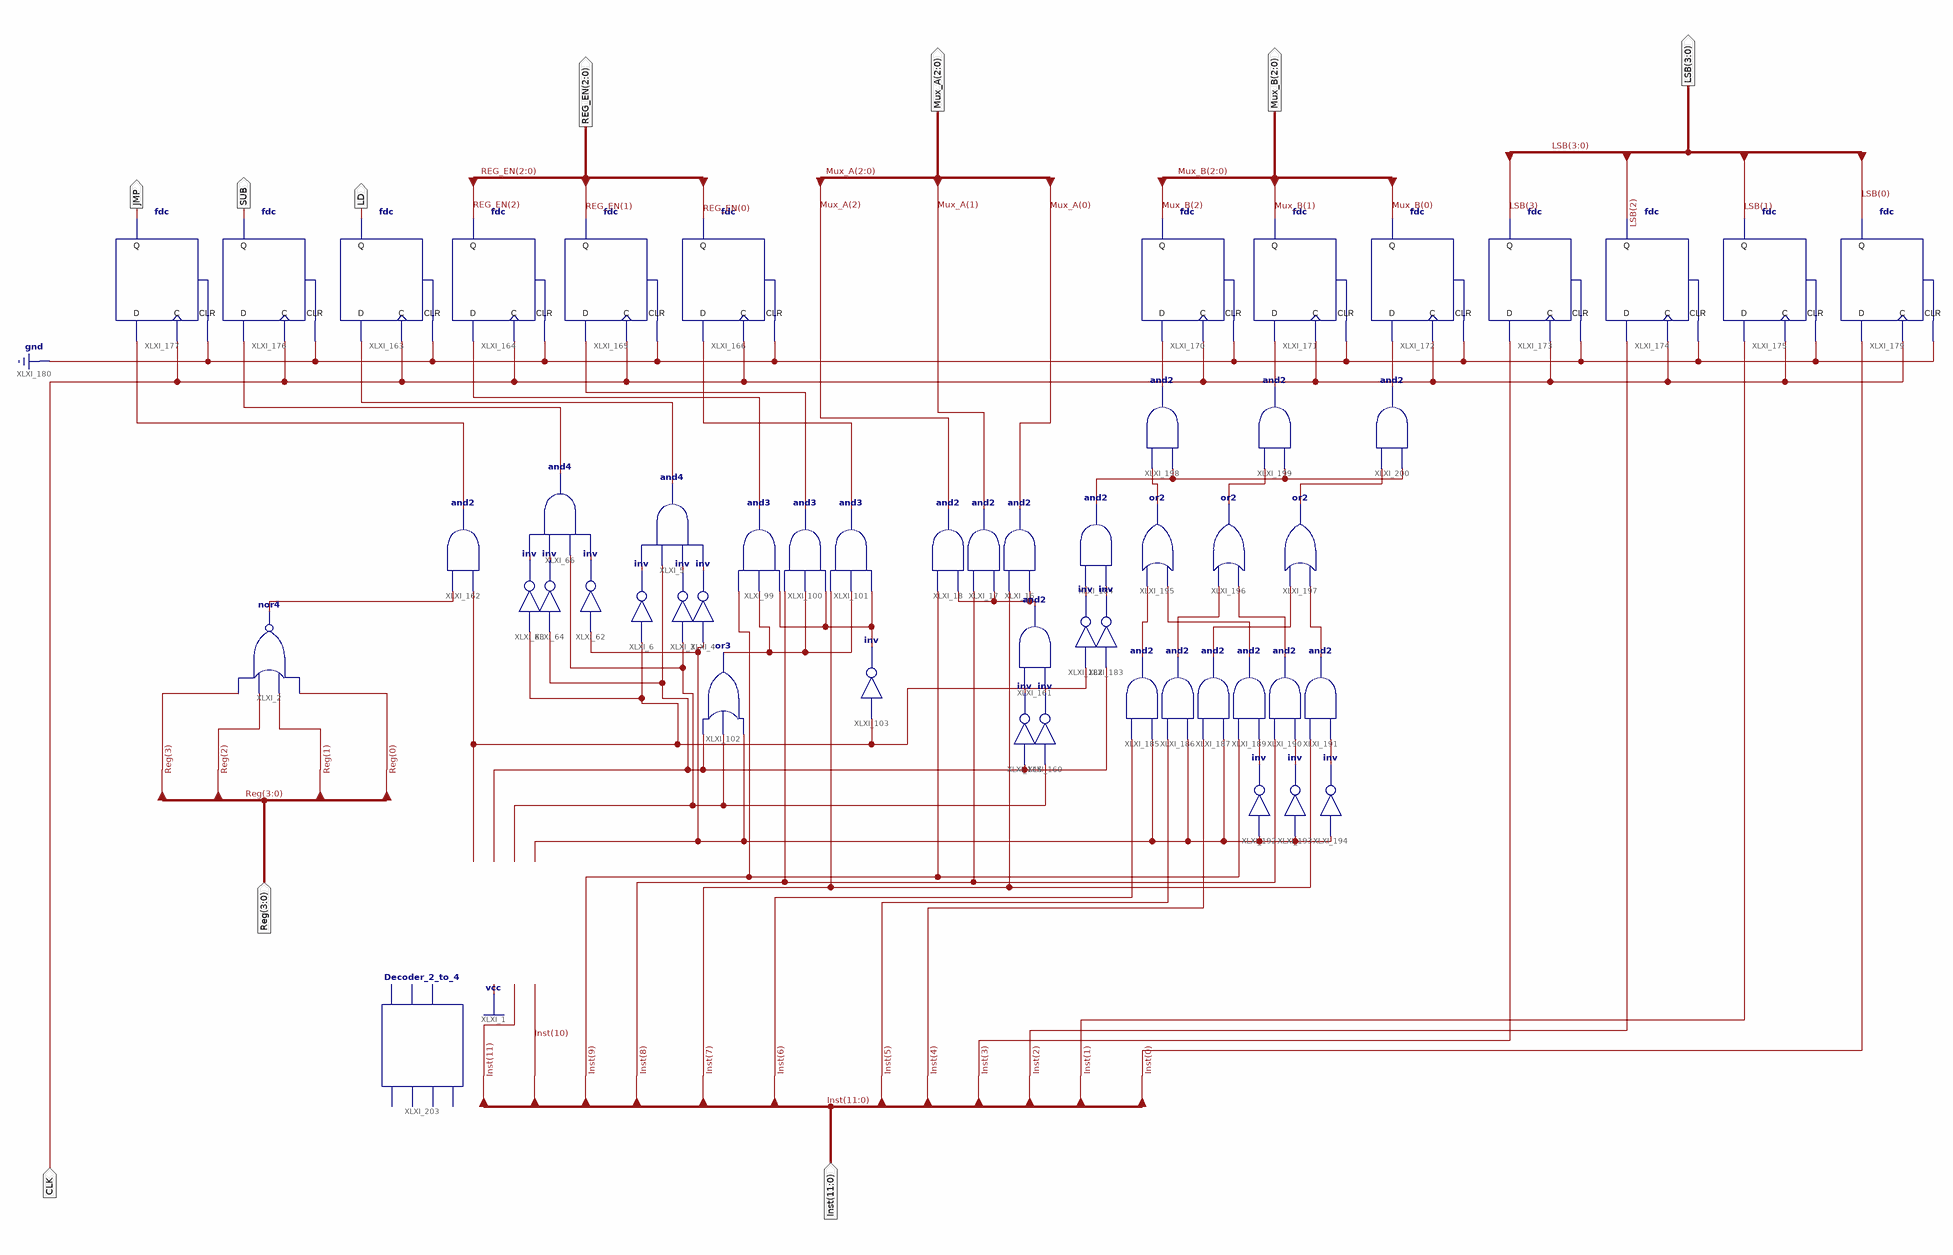
[diagram p0: schematic sheet 1]
// Xilinx ISE schematic new_Ins_dec.sch (spartan3e) as structural Verilog: 53 symbols, 10 ports
module new_Ins_dec (
  input  [11:0] Inst,
  input  [3:0] Reg,
  input  CLK,
  output JMP,
  output SUB,
  output LD,
  output [2:0] REG_EN,
  output [2:0] Mux_A,
  output [2:0] Mux_B,
  output [3:0] LSB
);

  wire XLXN_17, XLXN_25, XLXN_26, XLXN_27, XLXN_28, XLXN_126, XLXN_127, XLXN_128, XLXN_157, XLXN_158,
       XLXN_159, XLXN_193, XLXN_273, XLXN_275, XLXN_276, XLXN_283, XLXN_285, XLXN_286, XLXN_292, XLXN_293,
       XLXN_294, XLXN_330, XLXN_332, XLXN_335, XLXN_336, XLXN_337, XLXN_338, XLXN_339, XLXN_340, XLXN_341,
       XLXN_342, XLXN_343, XLXN_344, XLXN_345, XLXN_346, XLXN_347, XLXN_352, XLXN_353, XLXN_354, XLXN_355;

  nor XLXI_2 (XLXN_352, Reg[0], Reg[1], Reg[2], Reg[3]);
  not XLXI_3 (XLXN_127, XLXN_27);
  not XLXI_4 (XLXN_128, XLXN_28);
  and XLXI_5 (XLXN_286, XLXN_128, XLXN_127, XLXN_26, XLXN_126);
  not XLXI_6 (XLXN_126, XLXN_25);
  not XLXI_63 (XLXN_157, XLXN_25);
  and XLXI_66 (XLXN_285, XLXN_159, XLXN_27, XLXN_158, XLXN_157);
  not XLXI_64 (XLXN_158, XLXN_26);
  not XLXI_62 (XLXN_159, XLXN_28);
  and XLXI_99 (XLXN_292, XLXN_193, XLXN_17, Inst[9]);
  and XLXI_100 (XLXN_293, XLXN_193, XLXN_17, Inst[8]);
  and XLXI_101 (XLXN_294, XLXN_193, XLXN_17, Inst[7]);
  or XLXI_102 (XLXN_17, XLXN_28, XLXN_27, XLXN_26);
  not XLXI_103 (XLXN_193, XLXN_25);
  and XLXI_16 (Mux_A[0], XLXN_276, Inst[7]);
  and XLXI_17 (Mux_A[1], XLXN_276, Inst[8]);
  and XLXI_18 (Mux_A[2], XLXN_276, Inst[9]);
  and XLXI_161 (XLXN_276, XLXN_275, XLXN_273);
  and XLXI_162 (XLXN_283, XLXN_25, XLXN_352);
  fdc XLXI_163 (.C(CLK), .CLR(1'b0), .D(XLXN_286), .Q(LD));
  fdc XLXI_164 (.C(CLK), .CLR(1'b0), .D(XLXN_292), .Q(REG_EN[2]));
  fdc XLXI_165 (.C(CLK), .CLR(1'b0), .D(XLXN_293), .Q(REG_EN[1]));
  fdc XLXI_166 (.C(CLK), .CLR(1'b0), .D(XLXN_294), .Q(REG_EN[0]));
  fdc XLXI_170 (.C(CLK), .CLR(1'b0), .D(XLXN_353), .Q(Mux_B[2]));
  fdc XLXI_171 (.C(CLK), .CLR(1'b0), .D(XLXN_354), .Q(Mux_B[1]));
  fdc XLXI_172 (.C(CLK), .CLR(1'b0), .D(XLXN_355), .Q(Mux_B[0]));
  fdc XLXI_173 (.C(CLK), .CLR(1'b0), .D(Inst[3]), .Q(LSB[3]));
  fdc XLXI_174 (.C(CLK), .CLR(1'b0), .D(Inst[2]), .Q(LSB[2]));
  fdc XLXI_175 (.C(CLK), .CLR(1'b0), .D(Inst[1]), .Q(LSB[1]));
  fdc XLXI_176 (.C(CLK), .CLR(1'b0), .D(XLXN_285), .Q(SUB));
  fdc XLXI_179 (.C(CLK), .CLR(1'b0), .D(Inst[0]), .Q(LSB[0]));
  not XLXI_146 (XLXN_273, XLXN_26);
  not XLXI_160 (XLXN_275, XLXN_27);
  and XLXI_184 (XLXN_344, XLXN_332, XLXN_330);
  and XLXI_185 (XLXN_338, XLXN_28, Inst[6]);
  and XLXI_186 (XLXN_340, XLXN_28, Inst[5]);
  and XLXI_187 (XLXN_342, XLXN_28, Inst[4]);
  and XLXI_189 (XLXN_339, XLXN_335, Inst[9]);
  and XLXI_190 (XLXN_341, XLXN_336, Inst[8]);
  and XLXI_191 (XLXN_343, XLXN_337, Inst[7]);
  not XLXI_192 (XLXN_335, XLXN_28);
  not XLXI_193 (XLXN_336, XLXN_28);
  not XLXI_194 (XLXN_337, XLXN_28);
  or XLXI_197 (XLXN_347, XLXN_343, XLXN_342);
  or XLXI_195 (XLXN_345, XLXN_339, XLXN_338);
  or XLXI_196 (XLXN_346, XLXN_341, XLXN_340);
  and XLXI_198 (XLXN_353, XLXN_344, XLXN_345);
  and XLXI_199 (XLXN_354, XLXN_344, XLXN_346);
  and XLXI_200 (XLXN_355, XLXN_344, XLXN_347);
  not XLXI_183 (XLXN_332, XLXN_26);
  not XLXI_182 (XLXN_330, XLXN_25);
  Decoder_2_to_4 XLXI_203 (
    .EN(1'b1), .l0(Inst[10]), .l1(Inst[11]), .Y0(XLXN_28), .Y1(XLXN_27), .Y2(XLXN_26), .Y3(XLXN_25));
  fdc XLXI_177 (.C(CLK), .CLR(1'b0), .D(XLXN_283), .Q(JMP));
endmodule
